# Altium schematic sheet BQ25504v4.SchDoc: BQ25504
size A4; DrawnBy: Manuel Palacios
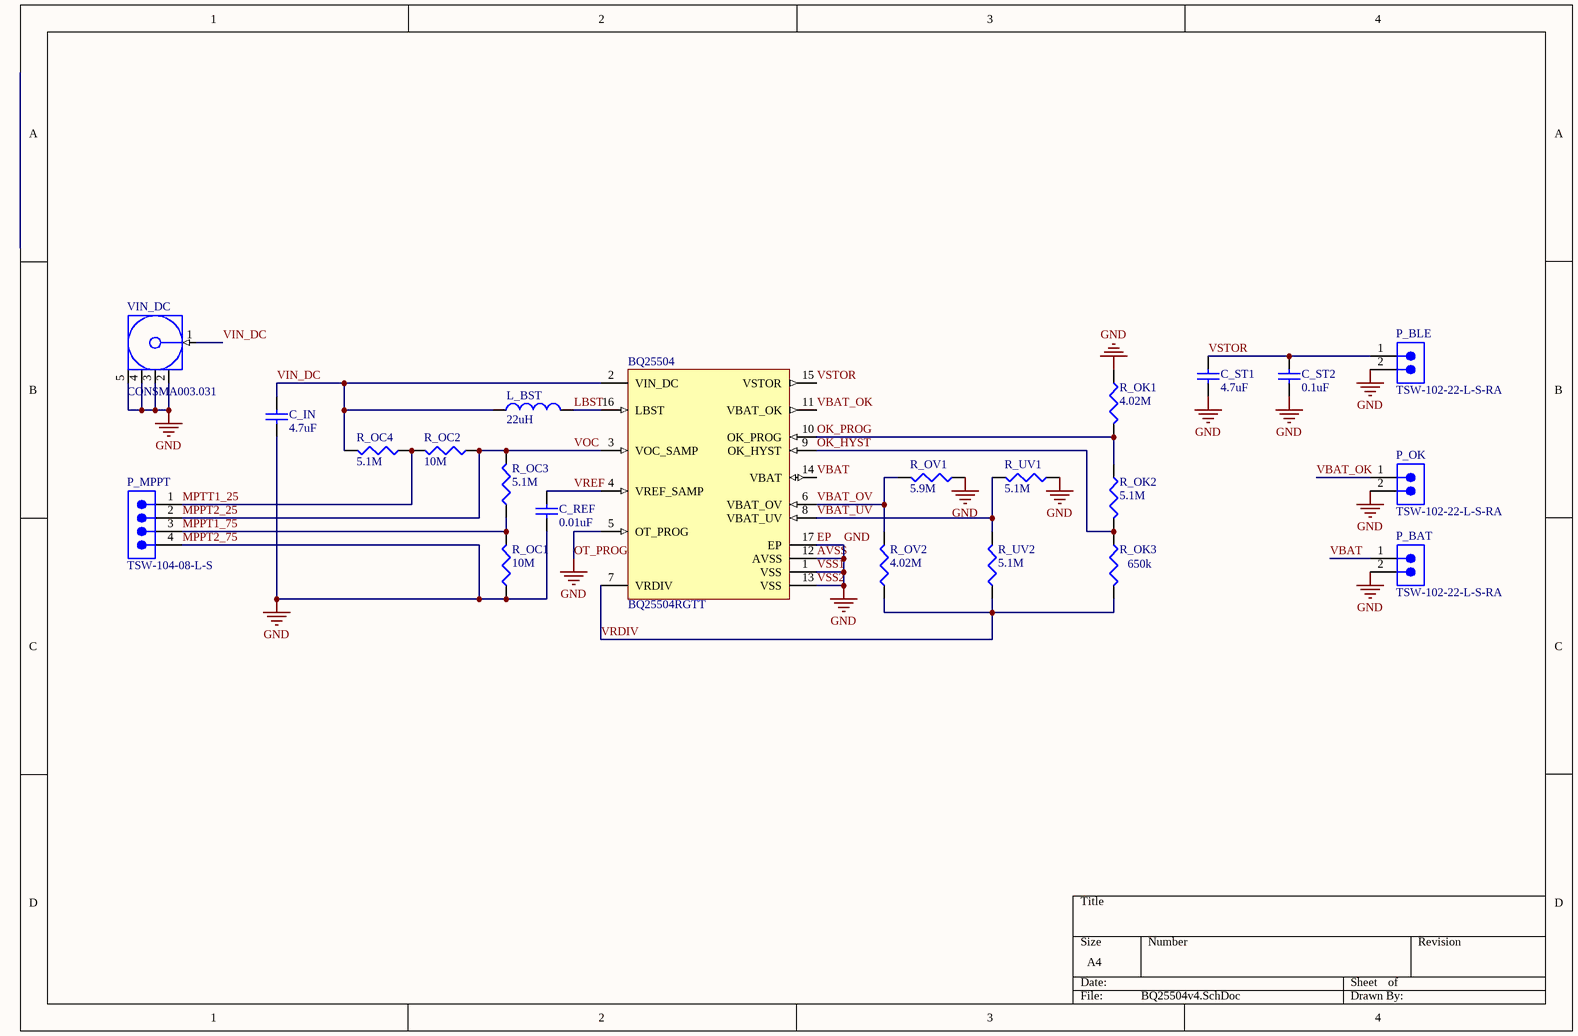
[diagram p0: BQ25504v4.SchDoc]

## Parts
BQ25504  BQ25504RGTT  [RGT0016C_V]
C_IN  value 4.7uF  [C0805]  (hidden comment: Cap Semi)
C_REF  value 0.01uF  [1608[0603]]  (hidden comment: Cap Semi)
C_ST1  value 4.7uF  [C0805]  (hidden comment: Cap Semi)
C_ST2  value 0.1uF  [1608[0603]]  (hidden comment: Cap Semi)
L_BST  value 22uH  [LPS4018]  (hidden comment: Inductor)
P_BAT  TSW-102-22-L-S-RA  [SMTC-TSW-102-22-X-S-RA]
P_BLE  TSW-102-22-L-S-RA  [SMTC-TSW-102-22-X-S-RA]
P_MPPT  TSW-104-08-L-S  [SMTC-TSW-104-08-X-S]
P_OK  TSW-102-22-L-S-RA  [SMTC-TSW-102-22-X-S-RA]
R_OC1  value 10M  [6-0805_N]  (hidden comment: Res3)
R_OC2  value 10M  [6-0805_N]  (hidden comment: Res3)
R_OC3  value 5.1M  [J1-0603]  (hidden comment: Res3)
R_OC4  value 5.1M  [J1-0603]  (hidden comment: Res3)
R_OK1  value 4.02M  [6-0805_N]  (hidden comment: Res3)
R_OK2  value 5.1M  [J1-0603]  (hidden comment: Res3)
R_OK3  value 650k  [J1-0603]  (hidden comment: Res3)
R_OV1  value 5.9M  [6-0805_N]  (hidden comment: Res3)
R_OV2  value 4.02M  [6-0805_N]  (hidden comment: Res3)
R_UV1  value 5.1M  [J1-0603]  (hidden comment: Res3)
R_UV2  value 5.1M  [J1-0603]  (hidden comment: Res3)
VIN_DC  CONSMA003.031  [CON-SMA-EDGE031]

## Nets
AVSS: BQ25504.1(VSS) BQ25504.5(OT_PROG) BQ25504.12(AVSS) BQ25504.13(VSS) BQ25504.17(EP) C_IN.1 C_REF.1 C_ST1.1 C_ST2.1 P_BAT.2 P_BLE.2 P_MPPT.4 P_OK.2 R_OC1.1 R_OK1.1 R_OV1.1 R_UV1.1 VIN_DC.2(GND) VIN_DC.3(GND) VIN_DC.4(GND) VIN_DC.5(GND)  [also labelled EP, GND, MPPT2_75, OT_PROG, VSS1, VSS2]
LBST: BQ25504.16(LBST) L_BST.2
MPPT1_75: P_MPPT.3 R_OC1.2 R_OC3.1
MPPT2_25: BQ25504.3(VOC_SAMP) P_MPPT.2 R_OC2.1 R_OC3.2  [also labelled VOC]
MPTT1_25: P_MPPT.1 R_OC2.2 R_OC4.1
OK_HYST: BQ25504.9(OK_HYST) R_OK2.2 R_OK3.1
OK_PROG: BQ25504.10(OK_PROG) R_OK1.2 R_OK2.1
VBAT: BQ25504.14(VBAT) P_BAT.1
VBAT_OK: BQ25504.11(VBAT_OK) P_OK.1
VBAT_OV: BQ25504.6(VBAT_OV) R_OV1.2 R_OV2.2
VBAT_UV: BQ25504.8(VBAT_UV) R_UV1.2 R_UV2.2
VIN_DC: BQ25504.2(VIN_DC) C_IN.2 L_BST.1 R_OC4.2 VIN_DC.1(Signal)
VRDIV: BQ25504.7(VRDIV) R_OK3.2 R_OV2.1 R_UV2.1
VREF: BQ25504.4(VREF_SAMP) C_REF.2
VSTOR: BQ25504.15(VSTOR) C_ST1.2 C_ST2.2 P_BLE.1

## Library data of the parts
BQ25504 = CMP-0321-00258-2: Ultra Low Power Boost Converter with Battery Management for Energy Harvester App, 0.13 V, -40 to 85 degC, 16-pin QFN (RGT), Green (RoHS & no Sb/Br); Manufacturer: Texas Instruments; Li-Ion: N; SubFamily: Battery Charge Management; Vin(Min)(V): 0.13; ComponentLink1URL: http://www.ti.com/general/docs/lit/getliterature.tsp?genericPartNumber=BQ25504&fileType=pdf; ComponentLink1Description: Datasheet; PartNumber: BQ25504RGTT; DatasheetVersion: SLUSAH0; PackageVersion: revH, Oct-2011; Lead Acid: N; PackageDescription: 16-Pin Plastic Quad Flat No-Lead, 3 x 3 mm Body, 0.5 mm Pitch, 1.7 x 1.7 mm Exposed Pad; Mounting Technology: Surface Mount; Eco-Plan: Green (RoHS & no Sb/Br); NiMH: N; PackageReference: RGT0016C; Over Voltage Protection: N; Li-Polymer: N; NiCd: N; Code_JEDEC: MO-220
C_IN C_REF C_ST1 C_ST2 = Cap Semi: Capacitor (Semiconductor SIM Model); Published: 8-Jun-2000; LatestRevisionDate: 29-May-2009; LatestRevisionNote: IPC-7351 Footprint Added.; PackageReference: C1206; Publisher: Altium Limited; PackageDescription: Chip Capacitor
L_BST = Inductor: Code_IEC: 1005; Published: 8-Jun-2000; LatestRevisionDate: 29-May-2009; LatestRevisionNote: IPC-7351 Footprint Added.; PackageReference: 0402-A; Publisher: Altium Limited; PackageDescription: Chip Inductor; Code_JEITA: 0402
P_BAT P_BLE P_OK = CMP-1024-00326-1: 0.025" SQ Post Header, Through-hole, Right Angle, -55 to 125 degC, 2.54 mm Pitch, 2-Pin, Male, RoHS; Manufacturer: Samtec; Pitch: 2.54 mm; ComponentLink3URL: http://www.samtec.com/documents/webfiles/cpdf/TSW-XXX-XX-XXX-X-XX-XXX-MKT.pdf; ComponentLink1URL: http://www.samtec.com; PackageReference: TSW-102-22-X-S-RA; Mounting Technology: Through-hole; ComponentLink1Description: Manufacturer URL; Orientation: Right Angle; ComponentLink2URL: http://www.samtec.com/documents/webfiles/pdf/TSW_TH.PDF; RoHS: True; DatasheetVersion: F-214; PackageDescription: .025[0.64] SQ. Post Terminal Strip Assembly; PackageVersion: DM, 8/1988; ComponentLink2Description: Datasheet; Temperature Range: -55 to 125 degC; ComponentLink3Description: Package Specification; PartNumber: TSW-102-22-L-S-RA
P_MPPT = CMP-1024-00358-1: 0.025" SQ Post Header, Through-hole, Vertical, -55 to 125 degC, 2.54 mm Pitch, 4-Pin, Male, RoHS; Manufacturer: Samtec; Pitch: 2.54 mm; PartNumber: TSW-104-08-L-S; RoHS: True; Temperature Range: -55 to 125 degC; PackageDescription: .025[0.64] SQ. Post Terminal Strip Assembly; Orientation: Vertical; ComponentLink2URL: http://www.samtec.com/documents/webfiles/pdf/TSW_TH.PDF; ComponentLink1Description: Manufacturer URL; ComponentLink2Description: Datasheet; PackageVersion: DM, 8/1988; ComponentLink3URL: http://www.samtec.com/documents/webfiles/cpdf/TSW-XXX-XX-XXX-X-XX-XXX-MKT.pdf; Mounting Technology: Through-hole; PackageReference: TSW-104-08-X-S; ComponentLink3Description: Package Specification; ComponentLink1URL: http://www.samtec.com; DatasheetVersion: F-214
R_OC1-R_OC4 R_OK1-R_OK3 R_OV1 R_OV2 R_UV1 R_UV2 = Res3: Resistor; Published: 8-Jun-2000; LatestRevisionDate: 29-May-2009; LatestRevisionNote: IPC-7351 Footprint Added.; PackageReference: J1-0603; Publisher: Altium Limited; PackageDescription: Chip Resistor
VIN_DC = CMP-0168-00026-1: SMA Female Edge Mount Connector for 0.031" Thick Board; PCB_Layout: Pads complies with manufacturer's recommendation.; PackageReference: CON-SMA-EDGE031; PackageDescription: SMA Female Edge Mount Connector for 0.031" Thick Board, 7.9 mm Body Dia.; DatasheetVersion: rev1.0, Jul-2006; PackageVersion: rev1.0, Jul-2006